# Altium schematic sheet DM1095_TopLevel.SchDoc: =project_title
size Tabloid; CompanyName: Luxonis Holding; Organization: Luxonis Holding; Address1: 1925 Harmony Park Drive; Address2: Westminster, CO; Address3: 80234; Address4: United States; SheetNumber: 2; SheetTotal: 9
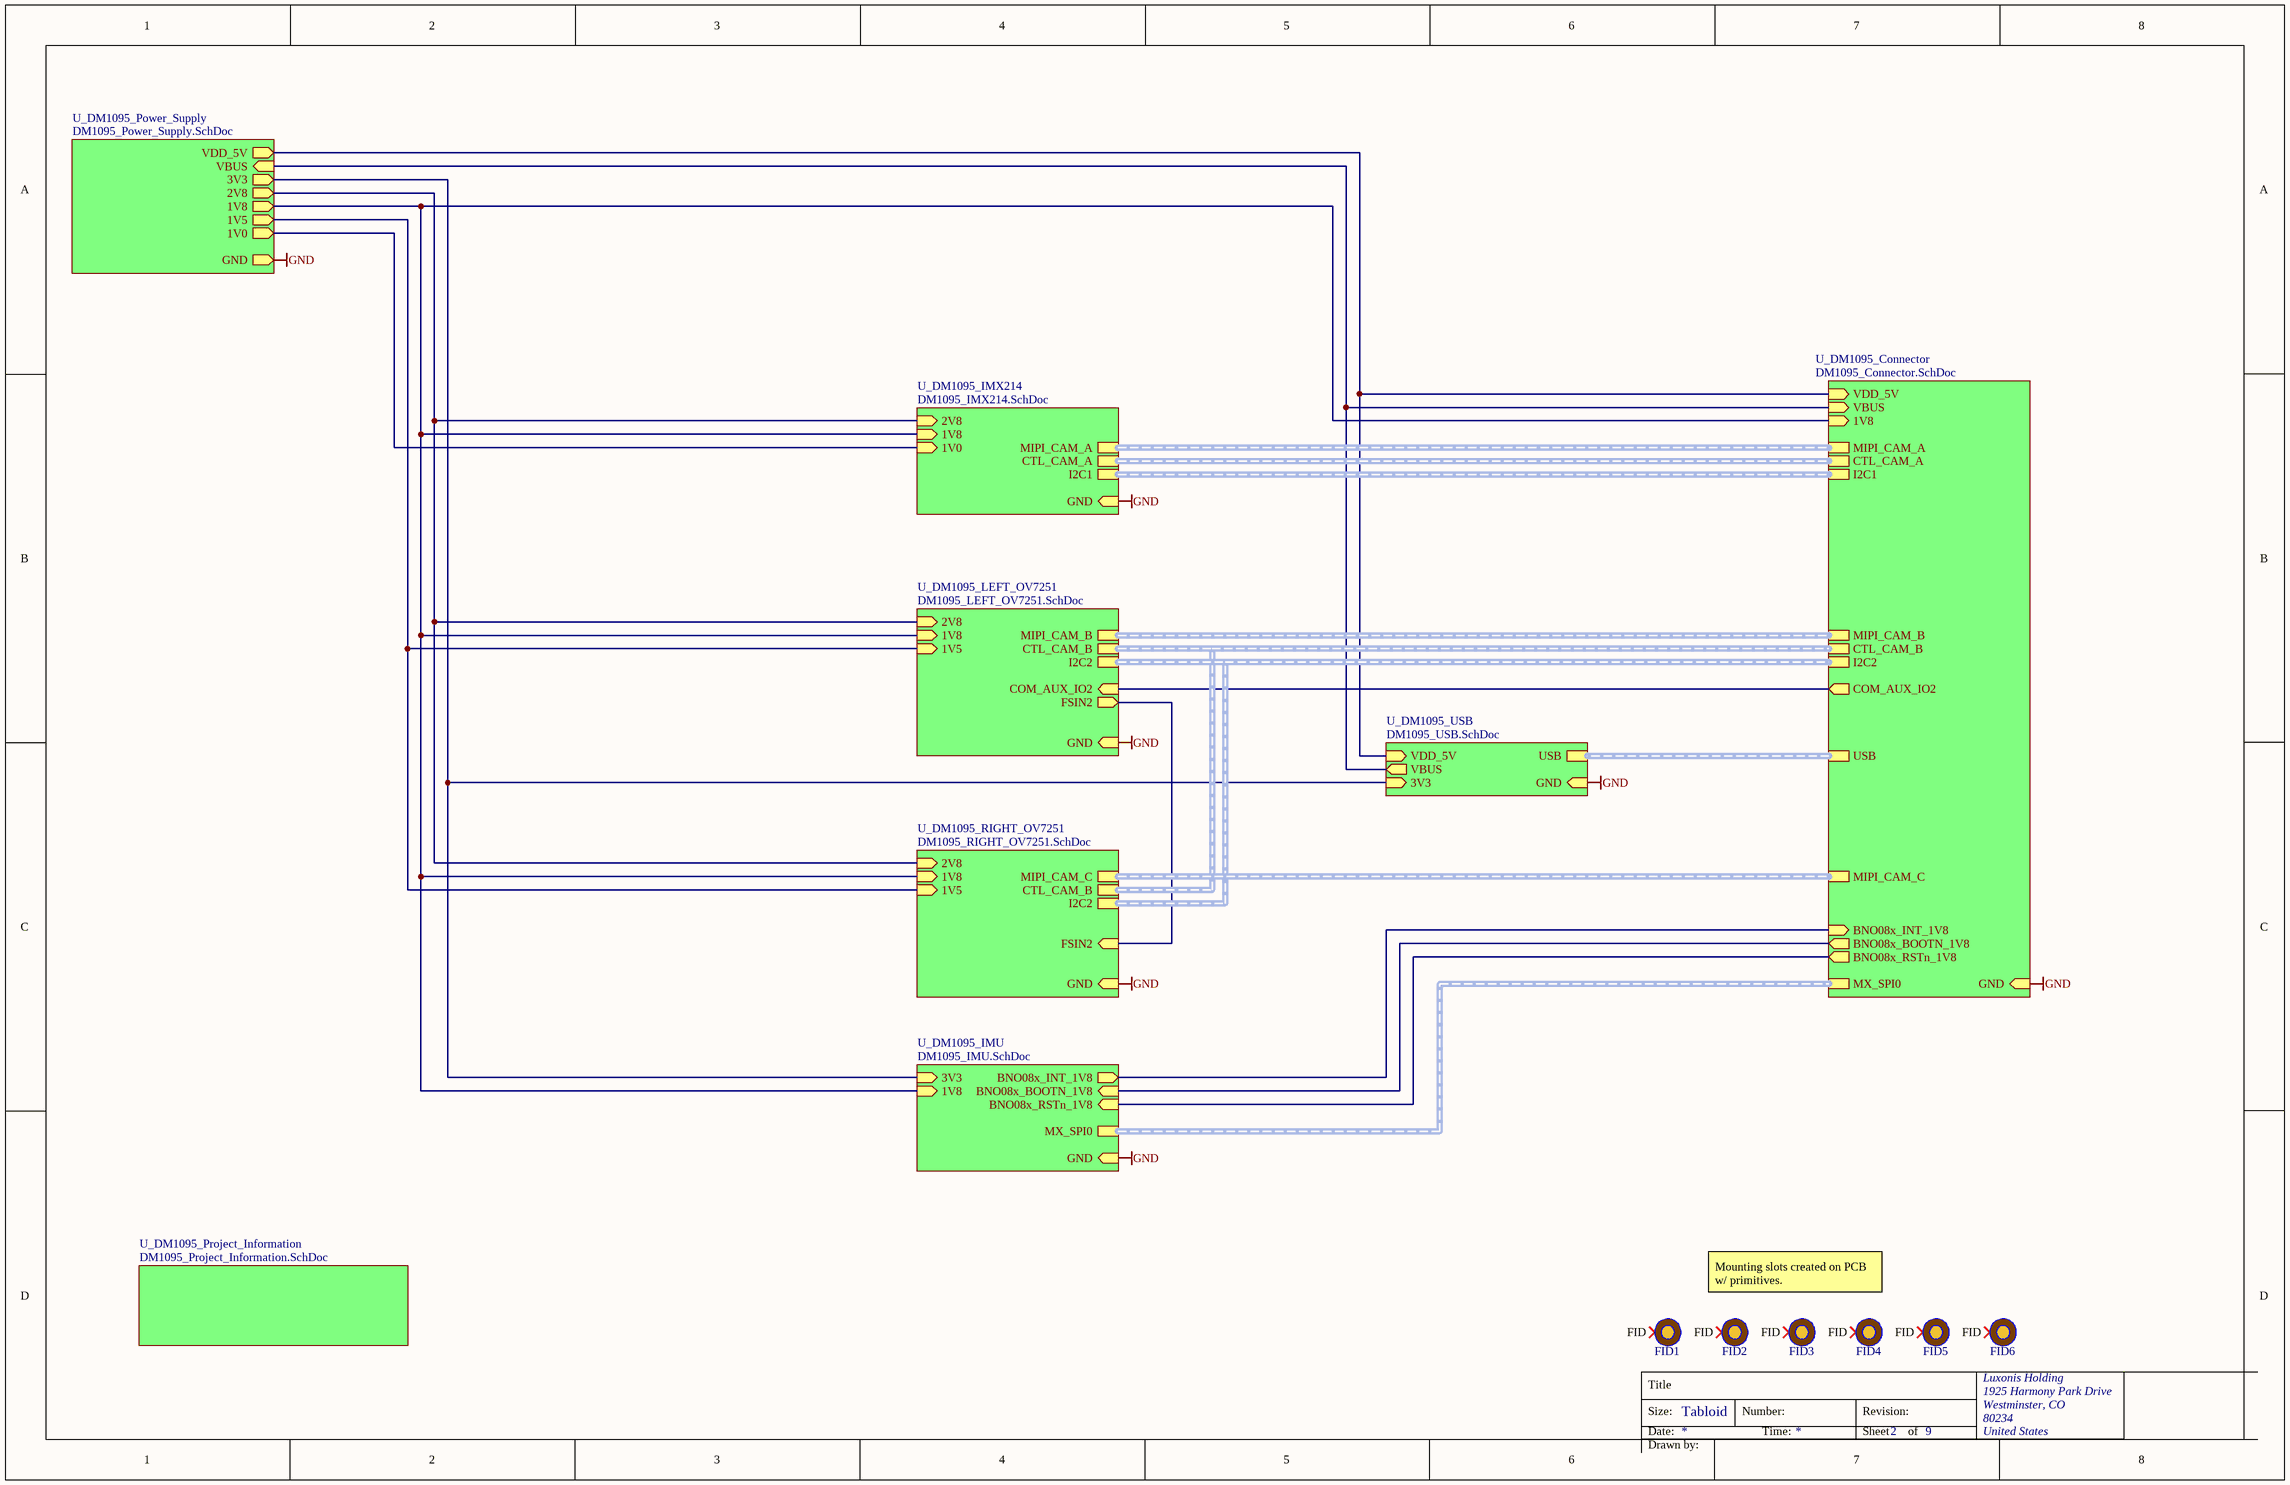
[diagram p0: DM1095_TopLevel.SchDoc]

## Parts
FID1  FIDUCIAL_ROUND_1MM  [FIDUCIAL_ROUND_1MM]  (value not drawn)  (no BOM)
FID2  FIDUCIAL_ROUND_1MM  [FIDUCIAL_ROUND_1MM]  (value not drawn)  (no BOM)
FID3  FIDUCIAL_ROUND_1MM  [FIDUCIAL_ROUND_1MM]  (value not drawn)  (no BOM)
FID4  FIDUCIAL_ROUND_1MM  [FIDUCIAL_ROUND_1MM]  (value not drawn)  (no BOM)
FID5  FIDUCIAL_ROUND_1MM  [FIDUCIAL_ROUND_1MM]  (value not drawn)  (no BOM)
FID6  FIDUCIAL_ROUND_1MM  [FIDUCIAL_ROUND_1MM]  (value not drawn)  (no BOM)

## Sub-sheets
U_DM1095_Connector = DM1095_Connector.SchDoc: MIPI_CAM_B (harness MIPI_CAM_B), MIPI_CAM_A (harness MIPI_CAM_A), MIPI_CAM_C (harness MIPI_CAM_C), I2C2 (harness I2C2), I2C1 (harness I2C1), CTL_CAM_A (harness CTL_CAM_A), CTL_CAM_B (harness CTL_CAM_B), VDD_5V (in), GND (in), VBUS (in), USB (harness USB), COM_AUX_IO2 (out), BNO08x_BOOTN_1V8 (out), BNO08x_RSTn_1V8 (out), BNO08x_INT_1V8 (in), MX_SPI0 (harness MX_SPI0), 1V8 (in)
U_DM1095_IMU = DM1095_IMU.SchDoc: BNO08x_BOOTN_1V8 (in), GND (in), 3V3 (in), BNO08x_INT_1V8 (out), BNO08x_RSTn_1V8 (in), 1V8 (in), MX_SPI0 (harness MX_SPI0)
U_DM1095_IMX214 = DM1095_IMX214.SchDoc: 2V8 (in), 1V0 (in), I2C1 (harness I2C1), MIPI_CAM_A (harness MIPI_CAM_A), CTL_CAM_A (harness CTL_CAM_A), GND (in), 1V8 (in)
U_DM1095_LEFT_OV7251 = DM1095_LEFT_OV7251.SchDoc: I2C2 (harness I2C2), CTL_CAM_B (harness CTL_CAM_B), MIPI_CAM_B (harness MIPI_CAM_B), 1V5 (in), 2V8 (in), GND (in), 1V8 (in), FSIN2 (out), COM_AUX_IO2 (in)
U_DM1095_Power_Supply = DM1095_Power_Supply.SchDoc: 1V5 (out), 2V8 (out), GND (out), 1V8 (out), VDD_5V (out), VBUS (in), 3V3 (out), 1V0 (out)
U_DM1095_Project_Information = DM1095_Project_Information.SchDoc: no entries
U_DM1095_RIGHT_OV7251 = DM1095_RIGHT_OV7251.SchDoc: MIPI_CAM_C (harness MIPI_CAM_C), I2C2 (harness I2C2), 1V5 (in), 2V8 (in), GND (in), 1V8 (in), FSIN2 (in), CTL_CAM_B (harness CTL_CAM_B)
U_DM1095_USB = DM1095_USB.SchDoc: USB (harness USB), VBUS (out), GND (in), 3V3 (in), VDD_5V (in)

## Nets
GND: sheet U_DM1095_Power_Supply/GND, sheet U_DM1095_Connector/GND, sheet U_DM1095_IMX214/GND, sheet U_DM1095_RIGHT_OV7251/GND, sheet U_DM1095_LEFT_OV7251/GND, sheet U_DM1095_USB/GND, sheet U_DM1095_IMU/GND
(unnamed): sheet U_DM1095_Power_Supply/1V5, sheet U_DM1095_RIGHT_OV7251/1V5, sheet U_DM1095_LEFT_OV7251/1V5
(unnamed): sheet U_DM1095_Power_Supply/2V8, sheet U_DM1095_IMX214/2V8, sheet U_DM1095_RIGHT_OV7251/2V8, sheet U_DM1095_LEFT_OV7251/2V8
(unnamed): sheet U_DM1095_Power_Supply/1V8, sheet U_DM1095_Connector/1V8, sheet U_DM1095_IMX214/1V8, sheet U_DM1095_RIGHT_OV7251/1V8, sheet U_DM1095_LEFT_OV7251/1V8, sheet U_DM1095_IMU/1V8
(unnamed): sheet U_DM1095_Power_Supply/VDD_5V, sheet U_DM1095_Connector/VDD_5V, sheet U_DM1095_USB/VDD_5V
(unnamed): sheet U_DM1095_Power_Supply/VBUS, sheet U_DM1095_Connector/VBUS, sheet U_DM1095_USB/VBUS
(unnamed): sheet U_DM1095_Power_Supply/3V3, sheet U_DM1095_USB/3V3, sheet U_DM1095_IMU/3V3
(unnamed): sheet U_DM1095_Power_Supply/1V0, sheet U_DM1095_IMX214/1V0
(unnamed): sheet U_DM1095_Connector/COM_AUX_IO2, sheet U_DM1095_LEFT_OV7251/COM_AUX_IO2
(unnamed): sheet U_DM1095_Connector/BNO08x_BOOTN_1V8, sheet U_DM1095_IMU/BNO08x_BOOTN_1V8
(unnamed): sheet U_DM1095_Connector/BNO08x_RSTn_1V8, sheet U_DM1095_IMU/BNO08x_RSTn_1V8
(unnamed): sheet U_DM1095_Connector/BNO08x_INT_1V8, sheet U_DM1095_IMU/BNO08x_INT_1V8
(unnamed): sheet U_DM1095_RIGHT_OV7251/FSIN2, sheet U_DM1095_LEFT_OV7251/FSIN2

Not connected (* = marked no-connect by the designer): FID1 FID*; FID2 FID*; FID3 FID*; FID4 FID*; FID5 FID*; FID6 FID*

## Buses and harness runs
harness sheet U_DM1095_Connector/CTL_CAM_A = sheet U_DM1095_IMX214/CTL_CAM_A
harness sheet U_DM1095_Connector/CTL_CAM_B = sheet U_DM1095_LEFT_OV7251/CTL_CAM_B = sheet U_DM1095_RIGHT_OV7251/CTL_CAM_B
harness sheet U_DM1095_Connector/I2C1 = sheet U_DM1095_IMX214/I2C1
harness sheet U_DM1095_Connector/I2C2 = sheet U_DM1095_LEFT_OV7251/I2C2 = sheet U_DM1095_RIGHT_OV7251/I2C2
harness sheet U_DM1095_Connector/MIPI_CAM_A = sheet U_DM1095_IMX214/MIPI_CAM_A
harness sheet U_DM1095_Connector/MIPI_CAM_B = sheet U_DM1095_LEFT_OV7251/MIPI_CAM_B
harness sheet U_DM1095_Connector/MIPI_CAM_C = sheet U_DM1095_RIGHT_OV7251/MIPI_CAM_C
harness sheet U_DM1095_Connector/MX_SPI0 = sheet U_DM1095_IMU/MX_SPI0
harness sheet U_DM1095_Connector/USB = sheet U_DM1095_USB/USB

## Notes on the sheet
- Mounting slots created on PCB w/ primitives.
- Title
- Size:
- Date:
- Tabloid
- Number:
- Time:
- Revision:
- Sheet
- of
- Drawn by:

## Library data of the parts
FID1-FID6 = FIDUCIAL: Fiducial with various available footprints